# Altium schematic sheet Detector.SchDoc
size A4
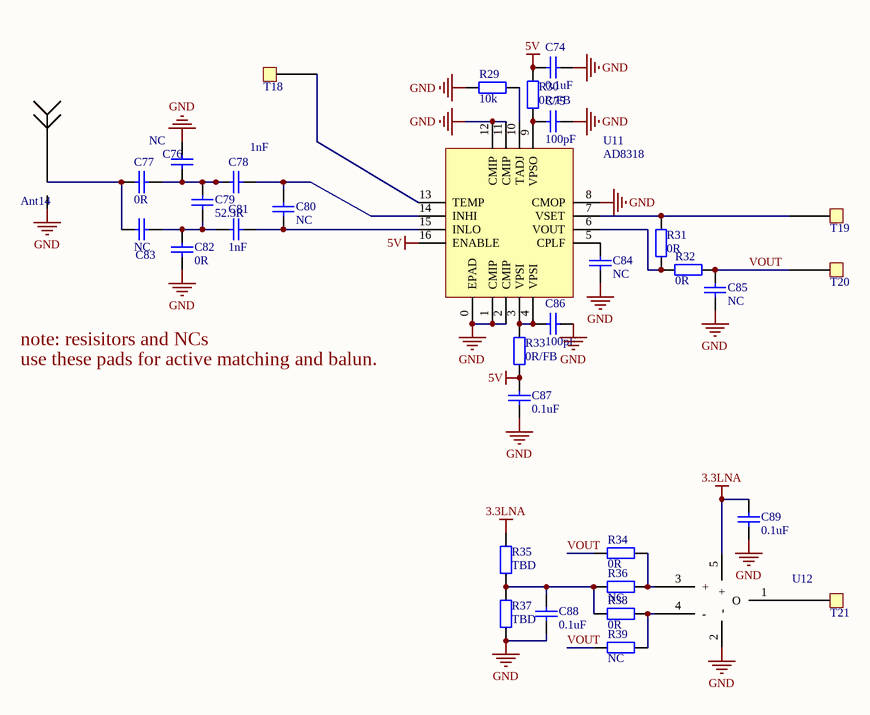
[diagram p0: Detector.SchDoc]

## Parts
Ant14  Antenna  [SMA-2]  (value not drawn)
C74  value 0.1uF  [0402]  (hidden comment: Cap)
C75  value 100pF  [0402]  (hidden comment: Cap)
C76  value NC  [0402]  (hidden comment: Cap)
C77  value 0R  [0402]  (hidden comment: Cap)
C78  value 1nF  [0402]  (hidden comment: Cap)
C79  value 52.3R  [0402]  (hidden comment: Cap)
C80  value NC  [0402]  (hidden comment: Cap)
C81  value 1nF  [0402]  (hidden comment: Cap)
C82  value 0R  [0402]  (hidden comment: Cap)
C83  value NC  [0402]  (hidden comment: Cap)
C84  value NC  [0402]  (hidden comment: Cap)
C85  value NC  [0402]  (hidden comment: Cap)
C86  value 100pF  [0402]  (hidden comment: Cap)
C87  value 0.1uF  [0402]  (hidden comment: Cap)
C88  value 0.1uF  [0402]  (hidden comment: Cap)
C89  value 0.1uF  [0402]  (hidden comment: Cap)
R29  value 10k  [0402]  (hidden comment: Res2)
R30  value 0R/FB  [0402]  (hidden comment: Res2)
R31  value 0R  [0402]  (hidden comment: Res2)
R32  value 0R  [0402]  (hidden comment: Res2)
R33  value 0R/FB  [0402]  (hidden comment: Res2)
R34  value 0R  [0402]  (hidden comment: Res2)
R35  value TBD  [0402]  (hidden comment: Res2)
R36  value NC  [0402]  (hidden comment: Res2)
R37  value TBD  [0402]  (hidden comment: Res2)
R38  value 0R  [0402]  (hidden comment: Res2)
R39  value NC  [0402]  (hidden comment: Res2)
T18  TestPad  [TestPad - 1mm]  (value not drawn)
T19  TestPad  [TestPad - 1mm]  (value not drawn)
T20  TestPad  [TestPad - 1mm]  (value not drawn)
T21  TestPad  [TestPad - 1mm]  (value not drawn)
U11  AD8318  [AD8318]
U12  CMP-SOT23  [SOT23-5]  (value not drawn)

## Nets
3.3LNA: C89.2 R35.1 U12.5(+)
5V: C74.2 C87.2 R30.1 R33.2 U11.16(ENABLE)
GND: Ant14.GND(G) C74.1 C75.1 C76.1 C82.1 C84.2 C85.2 C86.1 C87.1 C88.2 C89.1 R29.1 R37.1 U11.0(EPAD) U11.1(CMIP) U11.2(CMIP) U11.8(CMOP) U11.11(CMIP) U11.12(CMIP) U12.2(-)
VOUT: C85.1 R32.2 R34.2 R39.2 T20.1
NetAnt14_1: Ant14.1 C77.2 C83.2
NetC75_2: C75.2 R30.2 U11.9(VPSO)
NetC76_2: C76.2 C77.1 C78.2 C79.2
NetC78_1: C78.1 C80.2 U11.14(INHI)
NetC79_1: C79.1 C81.2 C82.2 C83.1
NetC80_1: C80.1 C81.1 U11.15(INLO)
NetC84_1: C84.1 U11.5(CPLF)
NetC86_2: C86.2 R33.1 U11.3(VPSI) U11.4(VPSI)
NetC88_1: C88.1 R35.2 R36.2 R37.2 R38.2
NetR29_2: R29.2 U11.10(TADJ)
NetR31_1: R31.1 T19.1 U11.7(VSET)
NetR31_2: R31.2 R32.1 U11.6(VOUT)
NetR34_1: R34.1 R36.1 U12.3(+)
NetR38_1: R38.1 R39.1 U12.4(-)
NetT18_1: T18.1 U11.13(TEMP)
NetT21_1: T21.1 U12.1(O)

## Notes on the sheet
- note: resisitors and NCs
- use these pads for active matching and balun.

## Library data of the parts
C74-C89 = Cap: Capacitor; Published: 8-Jun-2000; LatestRevisionDate: 17-Jul-2002; LatestRevisionNote: Re-released for DXP Platform.; PackageReference: RAD-0.3; Publisher: Altium Limited; PackageDescription: Radial Cap, Thru-Hole; 2 Leads; 0.3 in Pin Spacing
R29-R39 = Res2: Resistor; Published: 8-Jun-2000; LatestRevisionDate: 17-Jul-2002; LatestRevisionNote: Re-released for DXP Platform.; PackageReference: AXIAL-0.4; Publisher: Altium Limited; PackageDescription: Axial Device, Thru-Hole; 2 Leads; 0.4 in Pin Spacing